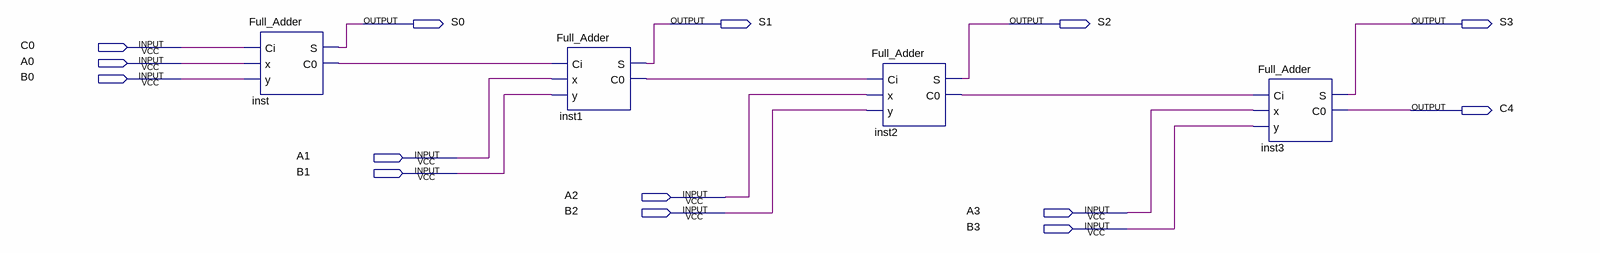
[diagram p0: schematic sheet]
// Quartus schematic 4bit_Full_Adder.bdf as structural Verilog: 4 symbols, 14 pins
module \4bit_Full_Adder  (
  input  C0,
  input  A0,
  input  B0,
  input  A1,
  input  B1,
  input  A2,
  input  B2,
  input  A3,
  input  B3,
  output S0,
  output S1,
  output S2,
  output S3,
  output C4
);

  wire inst1_c0, inst2_c0, inst_c0;

  Full_Adder inst (.Ci(C0), .x(A0), .y(B0), .S(S0), .C0(inst_c0));
  Full_Adder inst1 (.Ci(inst_c0), .x(A1), .y(B1), .S(S1), .C0(inst1_c0));
  Full_Adder inst2 (.Ci(inst1_c0), .x(A2), .y(B2), .S(S2), .C0(inst2_c0));
  Full_Adder inst3 (.Ci(inst2_c0), .x(A3), .y(B3), .S(S3), .C0(C4));
endmodule
